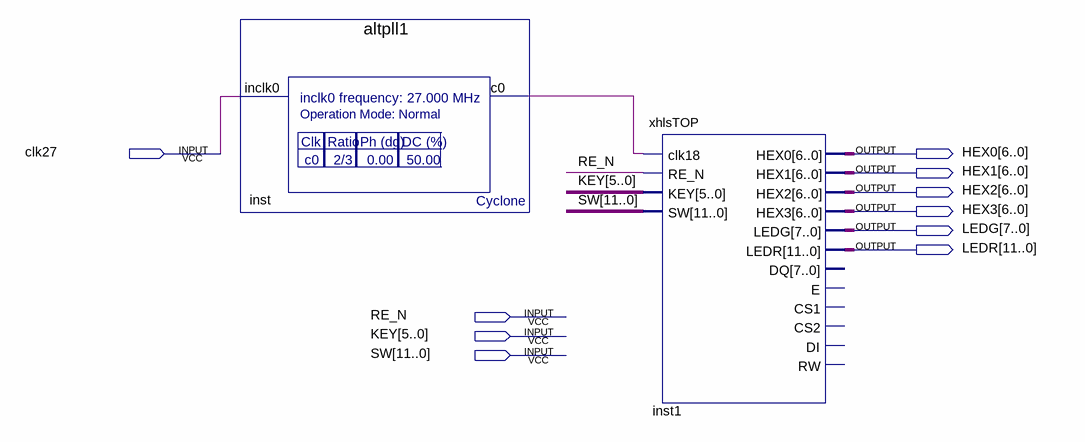
[diagram p0: schematic sheet]
// Quartus schematic 2013xhls.bdf as structural Verilog: 2 symbols, 10 pins
module \2013xhls  (
  input  clk27,
  input  RE_N,
  input  [5:0] KEY,
  input  [11:0] SW,
  output [6:0] HEX0,
  output [6:0] HEX1,
  output [6:0] HEX2,
  output [6:0] HEX3,
  output [7:0] LEDG,
  output [11:0] LEDR
);

  wire inst_c0;

  altpll1 inst (.inclk0(clk27), .c0(inst_c0));
  xhlsTOP inst1 (
    .clk18(inst_c0), .RE_N(RE_N), .KEY(KEY), .SW(SW), .HEX0(HEX0), .HEX1(HEX1), .HEX2(HEX2), .HEX3(HEX3),
    .LEDG(LEDG), .LEDR(LEDR));  // open: E, CS1, CS2, DI, RW, DQ
endmodule
